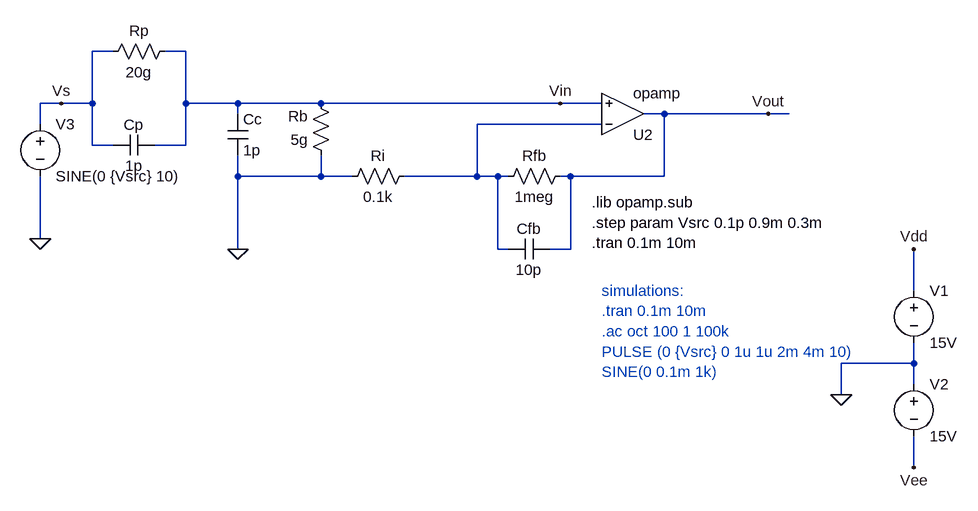
[diagram p0: schematic VoltageModeAmplifier2.asc]
VoltageModeAmplifier2.asc, the LTspice schematic file:
Version 4
SHEET 1 1256 680
WIRE -48 -128 -80 -128
WIRE 64 -128 32 -128
WIRE -128 -48 -160 -48
WIRE -80 -48 -80 -128
WIRE -80 -48 -128 -48
WIRE 64 -48 64 -128
WIRE 144 -48 64 -48
WIRE 272 -48 144 -48
WIRE 640 -48 272 -48
WIRE 704 -48 640 -48
WIRE 144 -32 144 -48
WIRE 800 -32 768 -32
WIRE 960 -32 800 -32
WIRE 992 -32 960 -32
WIRE -160 -16 -160 -48
WIRE 704 -16 512 -16
WIRE -80 16 -80 -48
WIRE -48 16 -80 16
WIRE 64 16 64 -48
WIRE 64 16 16 16
WIRE 144 64 144 32
WIRE 272 64 272 32
WIRE 272 64 144 64
WIRE 320 64 272 64
WIRE 512 64 512 -16
WIRE 512 64 400 64
WIRE 544 64 512 64
WIRE 560 64 544 64
WIRE 656 64 640 64
WIRE 800 64 800 -32
WIRE 800 64 656 64
WIRE -160 160 -160 64
WIRE 144 176 144 64
WIRE 544 176 544 64
WIRE 560 176 544 176
WIRE 656 176 656 64
WIRE 656 176 624 176
WIRE 1184 240 1184 176
WIRE 1184 352 1184 320
WIRE 1184 352 1072 352
WIRE 1184 384 1184 352
WIRE 1072 400 1072 352
WIRE 1184 512 1184 464
FLAG 1072 400 0
FLAG 1184 176 Vdd
FLAG 1184 512 Vee
FLAG 144 176 0
FLAG -160 160 0
FLAG 960 -32 Vout
FLAG -128 -48 Vs
FLAG 640 -48 Vin
SYMBOL voltage 1184 224 R0
SYMATTR InstName V1
SYMATTR Value 15V
SYMBOL voltage 1184 368 R0
SYMATTR InstName V2
SYMATTR Value 15V
SYMBOL voltage -160 -32 R0
SYMATTR InstName V3
SYMATTR Value SINE(0 {Vsrc} 10)
SYMATTR Value2 AC 1m
SYMBOL cap 16 0 R90
WINDOW 0 0 32 VBottom 2
WINDOW 3 32 32 VTop 2
SYMATTR InstName Cp
SYMATTR Value 1p
SYMBOL res 48 -144 R90
WINDOW 0 0 56 VBottom 2
WINDOW 3 32 56 VTop 2
SYMATTR InstName Rp
SYMATTR Value 20g
SYMBOL Opamps/opamp 736 32 M180
SYMATTR InstName U2
SYMBOL cap 624 160 R90
WINDOW 0 0 32 VBottom 2
WINDOW 3 32 32 VTop 2
SYMATTR InstName Cfb
SYMATTR Value 10p
SYMBOL res 416 48 R90
WINDOW 0 0 56 VBottom 2
WINDOW 3 32 56 VTop 2
SYMATTR InstName Ri
SYMATTR Value 0.1k
SYMBOL cap 128 -32 R0
SYMATTR InstName Cc
SYMATTR Value 1p
SYMBOL res 288 48 R180
WINDOW 0 36 76 Left 2
WINDOW 3 36 40 Left 2
SYMATTR InstName Rb
SYMATTR Value 5g
SYMBOL res 656 48 R90
WINDOW 0 0 56 VBottom 2
WINDOW 3 32 56 VTop 2
SYMATTR InstName Rfb
SYMATTR Value 1meg
TEXT 688 104 Left 2 !.lib opamp.sub\n.step param Vsrc 0.1p 0.9m 0.3m\n.tran 0.1m 10m
TEXT 704 240 Left 2 ;simulations:\n.tran 0.1m 10m\n.ac oct 100 1 100k\nPULSE (0 {Vsrc} 0 1u 1u 2m 4m 10)\nSINE(0 0.1m 1k)

The netlist it stands for:
* VoltageModeAmplifier2.asc
V1 Vdd 0 15V
V2 0 Vee 15V
V3 Vs 0 SINE(0 {Vsrc} 10) AC 1m
Cp Vin Vs 1p
Rp Vin Vs 20g
XU2 N001 Vin Vout opamp Aol=100K GBW=10Meg  ; pins invin noninvin out
Cfb Vout N001 10p
Ri N001 0 0.1k
Cc Vin 0 1p
Rb 0 Vin 5g
Rfb Vout N001 1meg
.lib opamp.sub
.step param Vsrc 0.1p 0.9m 0.3m
.tran 0.1m 10m
* simulations:
* .tran 0.1m 10m
* .ac oct 100 1 100k
* PULSE (0 {Vsrc} 0 1u 1u 2m 4m 10)
* SINE(0 0.1m 1k)
.backanno
.end